# Altium project CW330_NewKintexFPGA.PrjPcb (part 4 of 5)

## Sheet CW340_SPI_flashes.SchDoc: SPI Flash & Breakout
size Letter; Organization: NewAE Technology Inc.; Address1: 1083 Queen St., Suite 196; Address2: Halifax; Address3: NS; Address4: Canada B3H 0B2; DocumentNumber: .; Revision: .; SheetNumber: 24; SheetTotal: 31; SheetApproved: NO
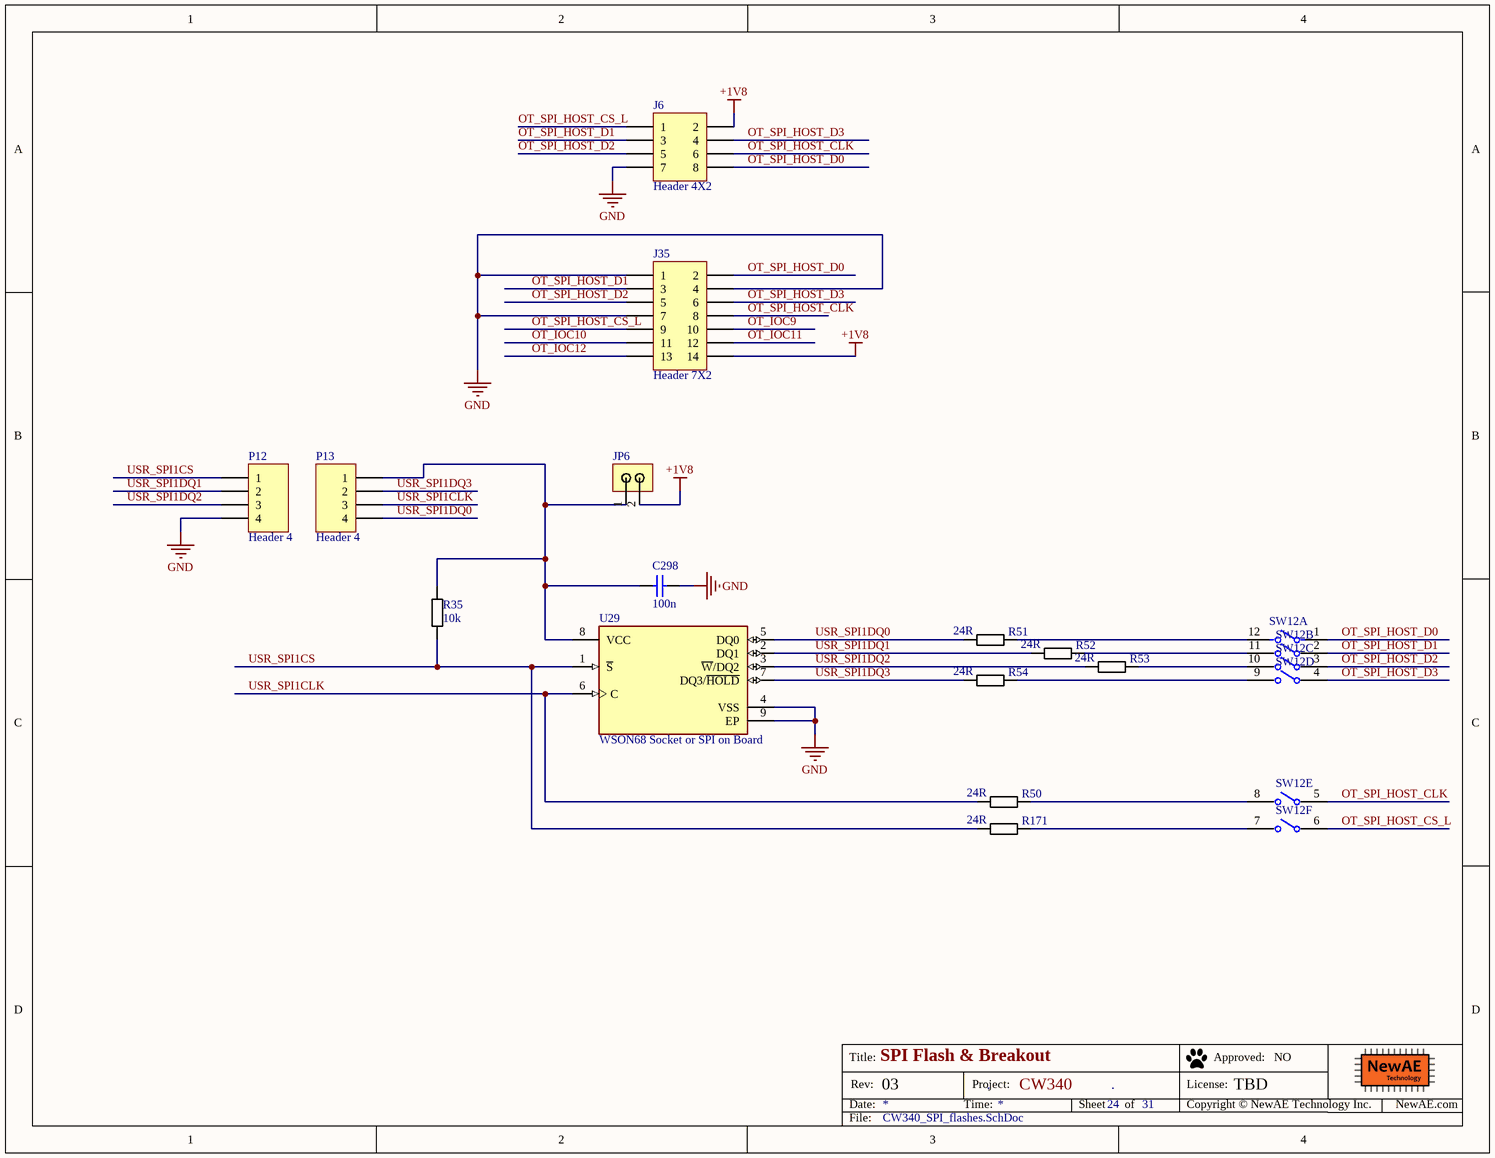
[diagram p21: CW340_SPI_flashes.SchDoc]

### Parts
C298  100n  [CAPC0402_M]
J6  Header 4X2  [HDR2X4]
J35  Header 7X2  [HDR2X7]
JP6  Jumper  [2x2.54mm_Header]  (value not drawn)
P12  Header 4  [HDR1X4]
P13  Header 4  [HDR1X4]
R35  10k  [RESC1005X40N]
R50  24R  [RESC1005X40N]
R51  24R  [RESC1005X40N]
R52  24R  [RESC1005X40N]
R53  24R  [RESC1005X40N]
R54  24R  [RESC1005X40N]
R171  24R  [RESC1005X40N]
SW12  A6H-6101-PM  [FP-A6H-6101-PM-MFG]  (value not drawn)  (parts A,B,C,D,E,F of 6)
U29  WSON68 Socket or SPI on Board  [SOK-SPI-WSON68_ORCHIP]

### Nets
+1V8: J6.2 J35.14 JP6.2
GND: C298.2 J6.7 J35.1 J35.4 J35.7 P12.4 U29.4(VSS) U29.9(EP)
OT_IOC9: J35.10
OT_IOC10: J35.11
OT_IOC11: J35.12
OT_IOC12: J35.13
OT_SPI_HOST_CLK: J6.6 J35.8 SW12.5
OT_SPI_HOST_CS_L: J6.1 J35.9 SW12.6
OT_SPI_HOST_D0: J6.8 J35.2 SW12.1
OT_SPI_HOST_D1: J6.3 J35.3 SW12.2
OT_SPI_HOST_D2: J6.5 J35.5 SW12.3
OT_SPI_HOST_D3: J6.4 J35.6 SW12.4
USR_SPI1CLK: P13.3 R50.1 U29.6(C)
USR_SPI1CS: P12.1 R35.2 R171.1 U29.1(~{S})
USR_SPI1DQ0: P13.4 R51.1 U29.5(DQ0)
USR_SPI1DQ1: P12.2 R52.1 U29.2(DQ1)
USR_SPI1DQ2: P12.3 R53.1 U29.3(~{W}/DQ2)
USR_SPI1DQ3: P13.2 R54.1 U29.7(DQ3/~{HOLD})
NetC298_1: C298.1 JP6.1 P13.1 R35.1 U29.8(VCC)
NetR50_2: R50.2 SW12.8
NetR51_2: R51.2 SW12.12
NetR52_2: R52.2 SW12.11
NetR53_2: R53.2 SW12.10
NetR54_2: R54.2 SW12.9
NetR171_2: R171.2 SW12.7

### Notes on the sheet
- Title:
- Date:
- Rev:
- Time:
- Project:
- Sheet
- of
- License:
- Copyright © NewAE Technology Inc.
- Approved:
- NewAE.com
- File:

### Library data of the parts
C298 = CCHIP-100n-0402: as C33 on sheet CW340_SAM3X_PWR; Part Number: CCHIP-100n-0402; Footprint: 0402; Pin Count: 2; Value: 100n; Mounting Technology: SMT; Component Kind: Standard; Component Type: Standard; Supplier 1: Digi-Key; Supplier Part Number 1: 445-6901-1-ND
J6 = Header 4X2: Header, 4-Pin, Dual row; LatestRevisionDate: 17-Jul-2002; LatestRevisionNote: Re-released for DXP Platform.; Publisher: Altium Limited
J35 = Header 7X2: Header, 7-Pin, Dual row; LatestRevisionDate: 17-Jul-2002; LatestRevisionNote: Re-released for DXP Platform.; Publisher: Altium Limited
JP6 = 2_PIN_JUMPER: 1x2 2.54mm header, male pins; Manufacture 1: Harwin; Manufacture Part Number 1: M20-9990246; Component Group: PCB Feature; PP Material Stack: 0; Part Number: 2_PIN_JUMPER; Pin Count: 2; Supplier 1: Digi-Key; Supplier Part Number 1: 952-2262-ND; Mounting Technology: Through-hole; RoHS: Yes; Component Kind: Standard; Component Type: Standard; PP Rotation: 0
P12 P13 = Header 4: Header, 4-Pin; LatestRevisionDate: 17-Jul-2002; LatestRevisionNote: Re-released for DXP Platform.; Publisher: Altium Limited
R35 = RCHIP-10K-0402: as R213-R220 on sheet CW340_STATUS_LEDs; Part Number: RCHIP-10K-0402; Footprint: 0402; Pin Count: 2; Supplier 1: Digi-Key; Supplier Part Number 1: 311-10.0KLRCT-ND; Value: 10k; Tolerance: 1%; Mounting Technology: SMT; Temperature Range: -55C to 155C; Component Kind: Standard; Component Type: Standard
R50-R54 R171 = RCHIP-24R-0402: 24R res, 0402, 1%, 1/16W; Manufacture 1: Yageo; Manufacture Part Number 1: RC0402FR-0724RL; Component Group: Resistor; Case-EIA: 0402; Case-Metric: 1005; Rated Power: 0.063W; Rated Voltage: 75VDC; Part Number: RCHIP-24R-0402; Footprint: 0402; Pin Count: 2; Supplier 1: Digi-Key; Supplier Part Number 1: YAG3073CT-ND; Value: 24R; Tolerance: 1%; Mounting Technology: SMT; Temperature Range: -55C to 155C; Component Kind: Standard; Component Type: Standard
SW12 = A6H-6101-PM: 6 DIP switch SMD; Manufacture 1: Omron; PP Material Stack: 0; Part Number: A6H-6101-PM; Component Group: Switch; Footprint: SSOP-12; Manufacture Part Number 1: A6H-6101-PM; Pin Count: 12; Component Kind: Standard; Component Type: Standard; PP Rotation: 0; PP Rotation1: 0
U29 = SOK-SPI-WSON68_OR_QSPI: WSON-6x8 Socket OR WSON Flash; Manufacture 1: Dedi-Prog/Micron; Manufacture Part Number 1: SOK-SPI-WSON68 / MT25QL256ABA1EW9-0SIT; Component Group: Connector; PP Material Stack: 0; Part Number: SOK-SPI-WSON68_OR_QSPI; Footprint: WSON-8x6; Pin Count: 8; Supplier 1: Digi-Key; Mounting Technology: SMT; RoHS: Yes; Component Kind: Standard; Component Type: Standard; PP Rotation: 0; PP Rotation1: 0

## Sheet CW340_EdgeConnector.SchDoc: Edge Connector
size Letter; Organization: NewAE Technology Inc.; Address1: 1083 Queen St., Suite 196; Address2: Halifax; Address3: NS; Address4: Canada B3H 0B2; SheetApproved: NO
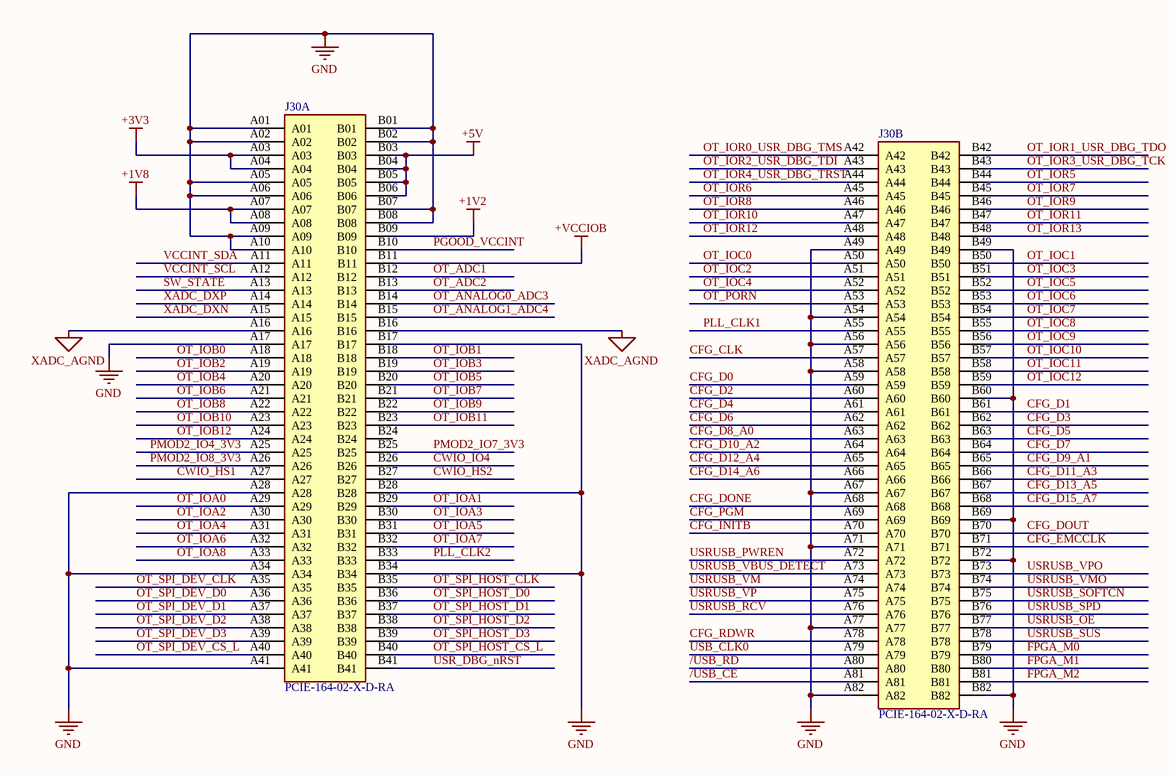
[diagram p22: CW340_EdgeConnector.SchDoc]

### Parts
J30  PCIE-164-02-X-D-RA  [SAMTEC_PCIE-164-02-X-D-RA]  (parts A,B of 2)

### Nets
+1V2: J30.B09
+1V8: J30.A07 J30.A08
+3V3: J30.A03 J30.A04
+5V: J30.B03 J30.B04 J30.B05 J30.B06
+VCCIOB: J30.B11
GND: J30.A01 J30.A02 J30.A05 J30.A06 J30.A09 J30.A10 J30.A17 J30.A28 J30.A34 J30.A41 J30.A49 J30.A54 J30.A56 J30.A58 J30.A67 J30.A71 J30.A77 J30.A82 J30.B01 J30.B02 J30.B07 J30.B08 J30.B17 J30.B28 J30.B34 J30.B49 J30.B60 J30.B69 J30.B72 J30.B82
XADC_AGND: J30.A16 J30.B16
/USB_CE: J30.A81
/USB_RD: J30.A80
CFG_CLK: J30.A57
CFG_D0: J30.A59
CFG_D1: J30.B61
CFG_D2: J30.A60
CFG_D3: J30.B62
CFG_D4: J30.A61
CFG_D5: J30.B63
CFG_D6: J30.A62
CFG_D7: J30.B64
CFG_D8_A0: J30.A63
CFG_D9_A1: J30.B65
CFG_D10_A2: J30.A64
CFG_D11_A3: J30.B66
CFG_D12_A4: J30.A65
CFG_D13_A5: J30.B67
CFG_D14_A6: J30.A66
CFG_D15_A7: J30.B68
CFG_DONE: J30.A68
CFG_DOUT: J30.B70
CFG_EMCCLK: J30.B71
CFG_INITB: J30.A70
CFG_PGM: J30.A69
CFG_RDWR: J30.A78
CWIO_HS1: J30.A27
CWIO_HS2: J30.B27
CWIO_IO4: J30.B26
FPGA_M0: J30.B79
FPGA_M1: J30.B80
FPGA_M2: J30.B81
OT_ADC1: J30.B12
OT_ADC2: J30.B13
OT_ANALOG0_ADC3: J30.B14
OT_ANALOG1_ADC4: J30.B15
OT_IOA0: J30.A29
OT_IOA1: J30.B29
OT_IOA2: J30.A30
OT_IOA3: J30.B30
OT_IOA4: J30.A31
OT_IOA5: J30.B31
OT_IOA6: J30.A32
OT_IOA7: J30.B32
OT_IOA8: J30.A33
OT_IOB0: J30.A18
OT_IOB1: J30.B18
OT_IOB2: J30.A19
OT_IOB3: J30.B19
OT_IOB4: J30.A20
OT_IOB5: J30.B20
OT_IOB6: J30.A21
OT_IOB7: J30.B21
OT_IOB8: J30.A22
OT_IOB9: J30.B22
OT_IOB10: J30.A23
OT_IOB11: J30.B23
OT_IOB12: J30.A24
OT_IOC0: J30.A50
OT_IOC1: J30.B50
OT_IOC2: J30.A51
OT_IOC3: J30.B51
OT_IOC4: J30.A52
OT_IOC5: J30.B52
OT_IOC6: J30.B53
OT_IOC7: J30.B54
OT_IOC8: J30.B55
OT_IOC9: J30.B56
OT_IOC10: J30.B57
OT_IOC11: J30.B58
OT_IOC12: J30.B59
OT_IOR0_USR_DBG_TMS: J30.A42
OT_IOR1_USR_DBG_TDO: J30.B42
OT_IOR2_USR_DBG_TDI: J30.A43
OT_IOR3_USR_DBG_TCK: J30.B43
OT_IOR4_USR_DBG_TRST: J30.A44
OT_IOR5: J30.B44
OT_IOR6: J30.A45
OT_IOR7: J30.B45
OT_IOR8: J30.A46
OT_IOR9: J30.B46
OT_IOR10: J30.A47
OT_IOR11: J30.B47
OT_IOR12: J30.A48
OT_IOR13: J30.B48
OT_PORN: J30.A53
OT_SPI_DEV_CLK: J30.A35
OT_SPI_DEV_CS_L: J30.A40
OT_SPI_DEV_D0: J30.A36
OT_SPI_DEV_D1: J30.A37
OT_SPI_DEV_D2: J30.A38
OT_SPI_DEV_D3: J30.A39
OT_SPI_HOST_CLK: J30.B35
OT_SPI_HOST_CS_L: J30.B40
OT_SPI_HOST_D0: J30.B36
OT_SPI_HOST_D1: J30.B37
OT_SPI_HOST_D2: J30.B38
OT_SPI_HOST_D3: J30.B39
PGOOD_VCCINT: J30.B10
PLL_CLK1: J30.A55
PLL_CLK2: J30.B33
PMOD2_IO4_3V3: J30.A25
PMOD2_IO7_3V3: J30.B25
PMOD2_IO8_3V3: J30.A26
SW_STATE: J30.A13
USB_CLK0: J30.A79
USR_DBG_nRST: J30.B41
USRUSB_OE: J30.B77
USRUSB_PWREN: J30.A72
USRUSB_RCV: J30.A76
USRUSB_SOFTCN: J30.B75
USRUSB_SPD: J30.B76
USRUSB_SUS: J30.B78
USRUSB_VBUS_DETECT: J30.A73
USRUSB_VM: J30.A74
USRUSB_VMO: J30.B74
USRUSB_VP: J30.A75
USRUSB_VPO: J30.B73
VCCINT_SCL: J30.A12  [project net PLL_SCL]
VCCINT_SDA: J30.A11  [project net PLL_SDA]
XADC_DXN: J30.A15
XADC_DXP: J30.A14

Not connected (* = marked no-connect by the designer): J30 B24

### Notes on the sheet
- Title:
- Date:
- Rev:
- Time:
- Project:
- Sheet
- of
- License:
- Copyright © NewAE Technology Inc.
- Approved:
- NewAE.com
- File:

### Library data of the parts
J30 = PCIE-164-02-X-D-RA: 1.00 mm PCI ExpressÂ® Edge Card Connector; MF: Samtec; Value: *; Price: None; Availability: Unavailable; Package: None; MP: PCIE-164-02-X-D-RA

## Sheet CW340_HyperDebug.SchDoc: <Enter Sheet Title>
size Letter; Organization: NewAE Technology Inc.; Address1: 1083 Queen St., Suite 196; Address2: Halifax; Address3: NS; Address4: Canada B3H 0B2; SheetApproved: NO
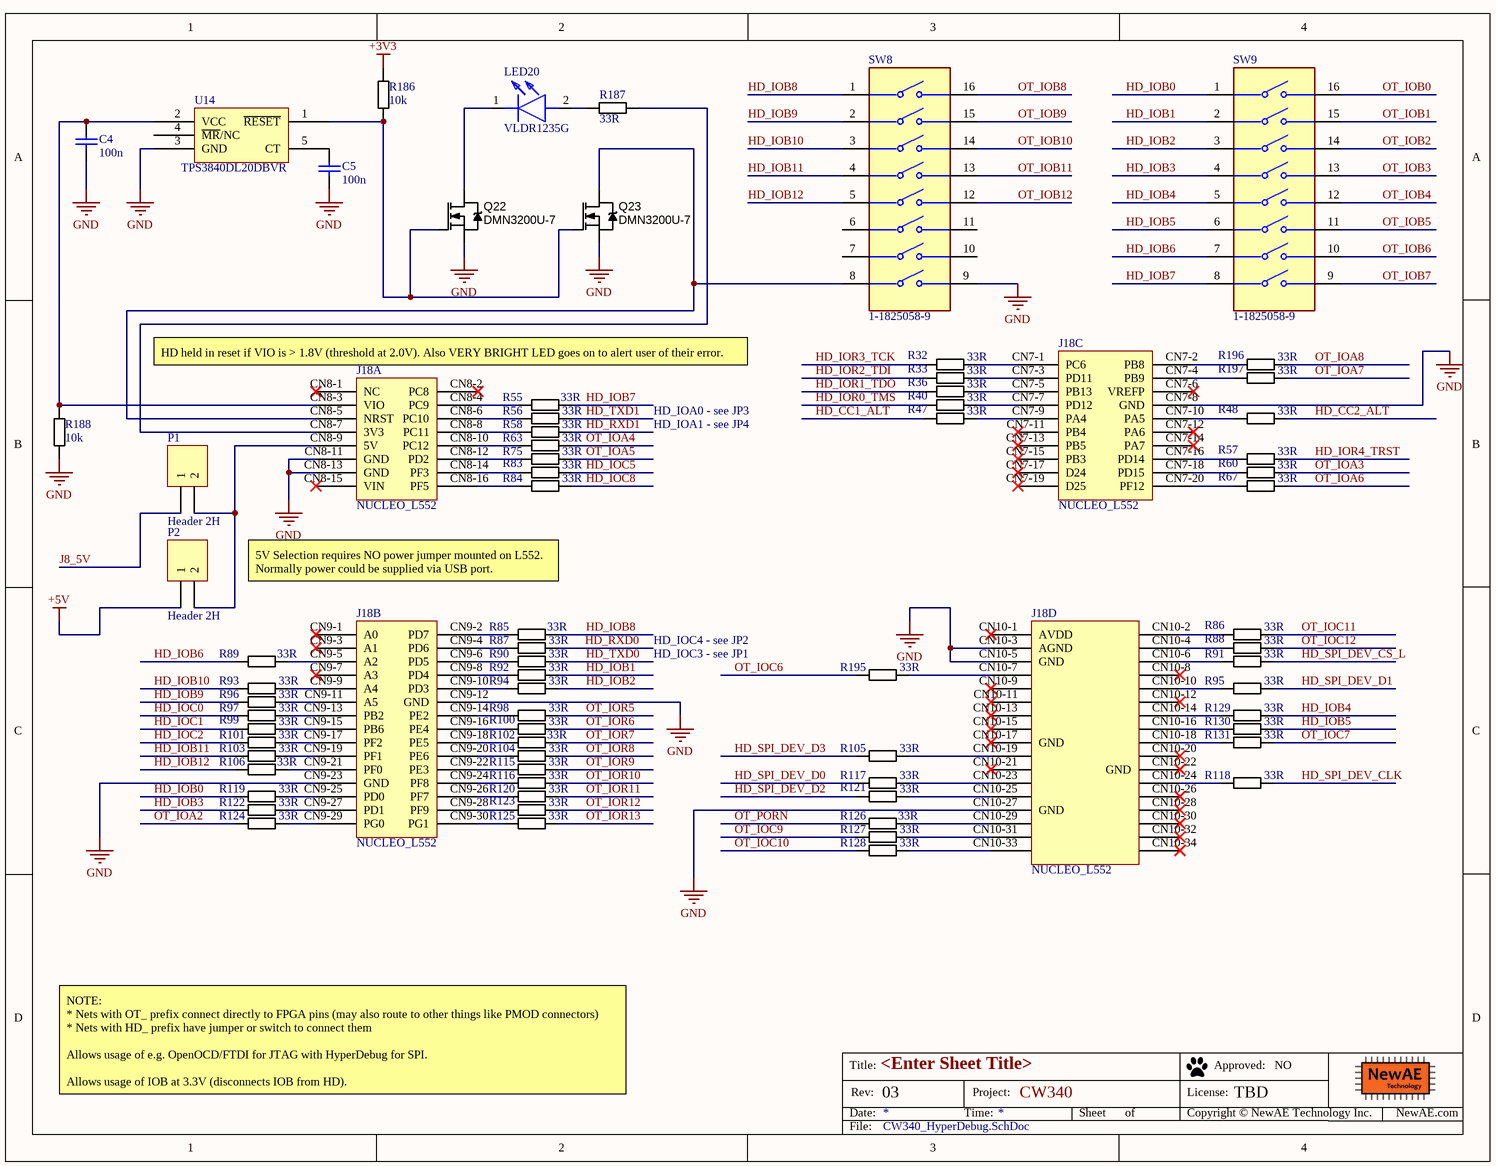
[diagram p23: CW340_HyperDebug.SchDoc]

### Parts
C4  100n  [CAPC0402_M]
C5  100n  [CAPC0402_M]
J18  NUCLEO_L552  [NUCLEO-L552ZE]  (parts A,B,C,D of 4)
LED20  VLDR1235G  [VLDR1235G]
P1  Header 2H  [HDR1X2H]
P2  Header 2H  [HDR1X2H]
Q22  DMN3200U-7  [SOT95P245X110-3M]
Q23  DMN3200U-7  [SOT95P245X110-3M]
R32  33R  [RESC1608X55N]
R33  33R  [RESC1608X55N]
R36  33R  [RESC1608X55N]
R40  33R  [RESC1608X55N]
R47  33R  [RESC1608X55N]
R48  33R  [RESC1608X55N]
R55  33R  [RESC1608X55N]
R56  33R  [RESC1608X55N]
R57  33R  [RESC1608X55N]
R58  33R  [RESC1608X55N]
R60  33R  [RESC1608X55N]
R63  33R  [RESC1608X55N]
R67  33R  [RESC1608X55N]
R75  33R  [RESC1608X55N]
R83  33R  [RESC1608X55N]
R84  33R  [RESC1608X55N]
R85  33R  [RESC1608X55N]
R86  33R  [RESC1608X55N]
R87  33R  [RESC1608X55N]
R88  33R  [RESC1608X55N]
R89  33R  [RESC1608X55N]
R90  33R  [RESC1608X55N]
R91  33R  [RESC1608X55N]
R92  33R  [RESC1608X55N]
R93  33R  [RESC1608X55N]
R94  33R  [RESC1608X55N]
R95  33R  [RESC1608X55N]
R96  33R  [RESC1608X55N]
R97  33R  [RESC1608X55N]
R98  33R  [RESC1608X55N]
R99  33R  [RESC1608X55N]
R100  33R  [RESC1608X55N]
R101  33R  [RESC1608X55N]
R102  33R  [RESC1608X55N]
R103  33R  [RESC1608X55N]
R104  33R  [RESC1608X55N]
R105  33R  [RESC1608X55N]
R106  33R  [RESC1608X55N]
R115  33R  [RESC1608X55N]
R116  33R  [RESC1608X55N]
R117  33R  [RESC1608X55N]
R118  33R  [RESC1608X55N]
R119  33R  [RESC1608X55N]
R120  33R  [RESC1608X55N]
R121  33R  [RESC1608X55N]
R122  33R  [RESC1608X55N]
R123  33R  [RESC1608X55N]
R124  33R  [RESC1608X55N]
R125  33R  [RESC1608X55N]
R126  33R  [RESC1608X55N]
R127  33R  [RESC1608X55N]
R128  33R  [RESC1608X55N]
R129  33R  [RESC1608X55N]
R130  33R  [RESC1608X55N]
R131  33R  [RESC1608X55N]
R186  10k  [RESC1005X40N]
R187  33R  [RESC1608X55N]
R188  10k  [RESC1005X40N]
R195  33R  [RESC1608X55N]
R196  33R  [RESC1608X55N]
R197  33R  [RESC1608X55N]
SW8  1-1825058-9  [FP-1-1825058-9-MFG]
SW9  1-1825058-9  [FP-1-1825058-9-MFG]
U14  TPS3840DL20DBVR  [SOT23-5P95_285X145L45X40]

### Nets
+3V3: R186.1
+5V: P2.1
GND: C4.2 C5.2 J18.CN7-8(GND) J18.CN8-11(GND) J18.CN8-13(GND) J18.CN9-12(GND) J18.CN9-23(GND) J18.CN10-3(AGND) J18.CN10-5(GND) J18.CN10-27(GND) Q22.2(S) Q23.2(S) R188.2 SW8.9 U14.3(GND)
HD_CC1_ALT: R47.1
HD_CC2_ALT: R48.2
HD_IOB0: R119.1 SW9.1
HD_IOB1: R92.2 SW9.2
HD_IOB2: R94.2 SW9.3
HD_IOB3: R122.1 SW9.4
HD_IOB4: R129.2 SW9.5
HD_IOB5: R130.2 SW9.6
HD_IOB6: R89.1 SW9.7
HD_IOB7: R55.2 SW9.8
HD_IOB8: R85.2 SW8.1
HD_IOB9: R96.1 SW8.2
HD_IOB10: R93.1 SW8.3
HD_IOB11: R103.1 SW8.4
HD_IOB12: R106.1 SW8.5
HD_IOC0: R97.1
HD_IOC1: R99.1
HD_IOC2: R101.1
HD_IOC5: R83.2
HD_IOC8: R84.2
HD_IOR0_TMS: R40.1
HD_IOR1_TDO: R36.1
HD_IOR2_TDI: R33.1
HD_IOR3_TCK: R32.1
HD_IOR4_TRST: R57.2
HD_RXD0: R87.2
HD_RXD1: R58.2
HD_SPI_DEV_CLK: R118.2
HD_SPI_DEV_CS_L: R91.2
HD_SPI_DEV_D0: R117.1
HD_SPI_DEV_D1: R95.2
HD_SPI_DEV_D2: R121.1
HD_SPI_DEV_D3: R105.1
HD_TXD0: R90.2
HD_TXD1: R56.2
J8_5V: P1.1
OT_IOA2: R124.1
OT_IOA3: R60.2
OT_IOA4: R63.2
OT_IOA5: R75.2
OT_IOA6: R67.2
OT_IOA7: R197.2
OT_IOA8: R196.2
OT_IOB0: SW9.16
OT_IOB1: SW9.15
OT_IOB2: SW9.14
OT_IOB3: SW9.13
OT_IOB4: SW9.12
OT_IOB5: SW9.11
OT_IOB6: SW9.10
OT_IOB7: SW9.9
OT_IOB8: SW8.16
OT_IOB9: SW8.15
OT_IOB10: SW8.14
OT_IOB11: SW8.13
OT_IOB12: SW8.12
OT_IOC6: R195.1
OT_IOC7: R131.2
OT_IOC9: R127.1
OT_IOC10: R128.1
OT_IOC11: R86.2
OT_IOC12: R88.2
OT_IOR5: R98.2
OT_IOR6: R100.2
OT_IOR7: R102.2
OT_IOR8: R104.2
OT_IOR9: R115.2
OT_IOR10: R116.2
OT_IOR11: R120.2
OT_IOR12: R123.2
OT_IOR13: R125.2
OT_PORN: R126.1
NetC4_1: C4.1 J18.CN8-3(VIO) R188.1 U14.2(VCC)
NetC5_1: C5.1 U14.5(CT)
NetJ18_CN7-1: J18.CN7-1(PC6) R32.2
NetJ18_CN7-2: J18.CN7-2(PB8) R196.1
NetJ18_CN7-3: J18.CN7-3(PD11) R33.2
NetJ18_CN7-4: J18.CN7-4(PB9) R197.1
NetJ18_CN7-5: J18.CN7-5(PB13) R36.2
NetJ18_CN7-7: J18.CN7-7(PD12) R40.2
NetJ18_CN7-9: J18.CN7-9(PA4) R47.2
NetJ18_CN7-10: J18.CN7-10(PA5) R48.1
NetJ18_CN7-16: J18.CN7-16(PD14) R57.1
NetJ18_CN7-18: J18.CN7-18(PD15) R60.1
NetJ18_CN7-20: J18.CN7-20(PF12) R67.1
NetJ18_CN8-4: J18.CN8-4(PC9) R55.1
NetJ18_CN8-5: J18.CN8-5(NRST) Q23.3(D) SW8.8
NetJ18_CN8-6: J18.CN8-6(PC10) R56.1
NetJ18_CN8-7: J18.CN8-7(3V3) R187.2
NetJ18_CN8-8: J18.CN8-8(PC11) R58.1
NetJ18_CN8-9: J18.CN8-9(5V) P1.2 P2.2
NetJ18_CN8-10: J18.CN8-10(PC12) R63.1
NetJ18_CN8-12: J18.CN8-12(PD2) R75.1
NetJ18_CN8-14: J18.CN8-14(PF3) R83.1
NetJ18_CN8-16: J18.CN8-16(PF5) R84.1
NetJ18_CN9-2: J18.CN9-2(PD7) R85.1
NetJ18_CN9-4: J18.CN9-4(PD6) R87.1
NetJ18_CN9-5: J18.CN9-5(A2) R89.2
NetJ18_CN9-6: J18.CN9-6(PD5) R90.1
NetJ18_CN9-8: J18.CN9-8(PD4) R92.1
NetJ18_CN9-9: J18.CN9-9(A4) R93.2
NetJ18_CN9-10: J18.CN9-10(PD3) R94.1
NetJ18_CN9-11: J18.CN9-11(A5) R96.2
NetJ18_CN9-13: J18.CN9-13(PB2) R97.2
NetJ18_CN9-14: J18.CN9-14(PE2) R98.1
NetJ18_CN9-15: J18.CN9-15(PB6) R99.2
NetJ18_CN9-16: J18.CN9-16(PE4) R100.1
NetJ18_CN9-17: J18.CN9-17(PF2) R101.2
NetJ18_CN9-18: J18.CN9-18(PE5) R102.1
NetJ18_CN9-19: J18.CN9-19(PF1) R103.2
NetJ18_CN9-20: J18.CN9-20(PE6) R104.1
NetJ18_CN9-21: J18.CN9-21(PF0) R106.2
NetJ18_CN9-22: J18.CN9-22(PE3) R115.1
NetJ18_CN9-24: J18.CN9-24(PF8) R116.1
NetJ18_CN9-25: J18.CN9-25(PD0) R119.2
NetJ18_CN9-26: J18.CN9-26(PF7) R120.1
NetJ18_CN9-27: J18.CN9-27(PD1) R122.2
NetJ18_CN9-28: J18.CN9-28(PF9) R123.1
NetJ18_CN9-29: J18.CN9-29(PG0) R124.2
NetJ18_CN9-30: J18.CN9-30(PG1) R125.1
NetJ18_CN10-2: J18.CN10-2 R86.1
NetJ18_CN10-4: J18.CN10-4 R88.1
NetJ18_CN10-6: J18.CN10-6 R91.1
NetJ18_CN10-7: J18.CN10-7 R195.2
NetJ18_CN10-10: J18.CN10-10 R95.1
NetJ18_CN10-14: J18.CN10-14 R129.1
NetJ18_CN10-16: J18.CN10-16 R130.1
NetJ18_CN10-18: J18.CN10-18 R131.1
NetJ18_CN10-19: J18.CN10-19 R105.2
NetJ18_CN10-23: J18.CN10-23 R117.2
NetJ18_CN10-24: J18.CN10-24 R118.1
NetJ18_CN10-25: J18.CN10-25 R121.2
NetJ18_CN10-29: J18.CN10-29 R126.2
NetJ18_CN10-31: J18.CN10-31 R127.2
NetJ18_CN10-33: J18.CN10-33 R128.2
NetLED20_1: LED20.1(K) Q22.3(D)
NetLED20_2: LED20.2(A) R187.1
NetQ22_1: Q22.1(G) Q23.1(G) R186.2 U14.1(~{RESET})

Not connected (* = marked no-connect by the designer): J18 CN7-6(VREFP)* CN7-11(PB4)* CN7-12(PA6)* CN7-13(PB5)* CN7-14(PA7)* CN7-15(PB3)* CN7-17(D24)* CN7-19(D25)* CN8-1(NC)* CN8-2(PC8)* CN8-15(VIN)* CN9-1(A0)* CN9-3(A1)* CN9-7(A3)* CN10-1(AVDD)* CN10-8* CN10-9* CN10-11* CN10-12* CN10-13* CN10-15* CN10-17(GND)* CN10-20* CN10-21* CN10-22(GND)* CN10-26* CN10-28* CN10-30* CN10-32* CN10-34*; SW8 6 7 10 11; U14 4(~{MR}/NC)

### Notes on the sheet
- HD held in reset if VIO is > 1.8V (threshold at 2.0V). Also VERY BRIGHT LED goes on to alert user of their error.
- HD_IOA0 - see JP3
- HD_IOA1 - see JP4
- 5V Selection requires NO power jumper mounted on L552. Normally power could be supplied via USB port.
- HD_IOC4 - see JP2
- HD_IOC3 - see JP1
- NOTE:
  * Nets with OT_ prefix connect directly to FPGA pins (may also route to other things like PMOD connectors)
  * Nets with HD_ prefix have jumper or switch to connect them
  Allows usage of e.g. OpenOCD/FTDI for JTAG with HyperDebug for SPI.
  Allows usage of IOB at 3.3V (disconnects IOB from HD).
- Title:
- Date:
- Rev:
- Time:
- Project:
- Sheet
- of
- License:
- Copyright © NewAE Technology Inc.
- Approved:
- NewAE.com
- File:

### Library data of the parts
C4 C5 = CCHIP-100n-0402: as C33 on sheet CW340_SAM3X_PWR; Part Number: CCHIP-100n-0402; Footprint: 0402; Pin Count: 2; Supplier 1: Digi-Key; Supplier Part Number 1: 445-6901-1-ND; Value: 100n; Mounting Technology: SMT; Component Kind: Standard; Component Type: Standard
J18 = NUCLEO_L552: PP Material Stack: 0; Part Number: NUCLEO_L552; Footprint: NUCLEO_L552; Component Kind: Standard; Component Type: Standard; PP Rotation: 0; PP Rotation1: 0
LED20 = VLDR1235G: LED; Manufacturer_Name: Vishay; Datasheet Link: https://componentsearchengine.com/Datasheets/2/VLDR1235G.pdf; Height: 3.02mm; Manufacturer_Part_Number: VLDR1235G; Mouser Part Number: 78-VLDR1235G; Mouser Price/Stock: https://www.mouser.co.uk/ProductDetail/Vishay-Semiconductors/VLDR1235G?qs=8%2FCviTG%2FVKTO7E0D0YN3Xw%3D%3D; Arrow Part Number: VLDR1235G; Arrow Price/Stock: https://www.arrow.com/en/products/vldr1235g/vishay?region=nac
P1 P2 = Header 2H: Header, 2-Pin, Right Angle; LatestRevisionDate: 17-Jul-2002; LatestRevisionNote: Re-released for DXP Platform.; Publisher: Altium Limited
Q22 Q23 = DMN3200U-7: MOSFET N-CH 30V 2.2A SOT23-3; Manufacture 1: Diodes Inc.; Rated Power: 3A; PP Material Stack: 0; Part Number: DMN3200U-7; Component Group: MOSFET; Footprint: SOT23; Manufacture Part Number 1: DMN3200U-7; Pin Count: 3; Supplier 1: Digi-Key; Supplier Part Number 1: DMN3200U-7DICT-ND; Rated Voltage: 30V; Mounting Technology: SMT; RoHS: Yes; Component Kind: Standard; Component Type: Standard; PP Rotation: 0
R32 R33 R36 R40 R47 R48 R55-R58 R60 R63 R67 R75 R83-R106 R115-R131 R187 R195-R197 = RCHIP-33R-0603: 33R res, 0603, 1%, 1/10W; Manufacture 1: Yageo; Manufacture Part Number 1: RC0603FR-0733RL; Component Group: Resistor; Case-EIA: 0603; Case-Metric: 1608; Rated Power: 0.1W; Rated Voltage: 75VDC; Part Number: RCHIP-33R-0603; Footprint: 0603; Pin Count: 2; Supplier 1: Digi-Key; Supplier Part Number 1: 311-33.0HRCT-ND; Value: 33R; Tolerance: 1%; Mounting Technology: SMT; Temperature Range: -55C to 155C; Component Kind: Standard; Component Type: Standard
R186 R188 = RCHIP-10K-0402: as R213-R220 on sheet CW340_STATUS_LEDs; Part Number: RCHIP-10K-0402; Footprint: 0402; Pin Count: 2; Supplier 1: Digi-Key; Supplier Part Number 1: 311-10.0KLRCT-ND; Value: 10k; Tolerance: 1%; Mounting Technology: SMT; Temperature Range: -55C to 155C; Component Kind: Standard; Component Type: Standard
SW8 SW9 = CMP-03400-000015-1: SWITCH SLIDE DIP SPST 100MA 24V; Manufacturer: TE Connectivity; Current Rating: 1A; Electromechanical Life: 1000Cycles; Contact Resistance: 50mΩ; Number Of Circuits: 8; Device Class L1: Electromechanical; Manufacturer Part Number: 1-1825058-9; Height: 5.1mm; ComponentLink2Description: Datasheet; Temperature Range High: +85°C; Digikey Description: SWITCH SLIDE DIP SPST 100MA 24V; Voltage Rating Dc: 24V; Package: 0; Automotive: No; ComponentLink2URL: https://www.te.com/commerce/DocumentDelivery/DDEController?Action=showdoc&DocId=Customer+Drawing%7F1825058%7FS5%7Fpdf%7FEnglish%7FENG_CD_1825058_S5.pdf%7F1-1825058-9; Octopart: https://octopart.com/1-1825058-9-te+connectivity-46507285; Temperature Range Low: -30°C; Device Class L2: Switches; Contact Current Rating: 100mA; Mount: Surface Mount; Temperature: -30°C to +85°C; Category: Switch; Device Class L3: DIP Switches; Lead Free: Yes; Throw Configuration: SPST; RoHS: TRUE
U14 = TPS3840DL20DBVR: Reset Supervisor; Manufacture 1: Texas Instruments; Component Group: Analog IC; PP Material Stack: 0; Part Number: TPS3840DL20DBVR; Footprint: SOT25; Manufacture Part Number 1: TPS3840DL20DBVR; Pin Count: 5; Supplier 1: Digi-Key; Supplier Part Number 1: TPS3840DL20DBVRCT-ND; Mounting Technology: SMT; RoHS: Yes; Component Kind: Standard; Component Type: Standard; PP Rotation: 0

## Sheet CW340_FTDI.SchDoc: FTDI Controller
size Letter; Organization: NewAE Technology Inc.; Address1: 1083 Queen St., Suite 196; Address2: Halifax; Address3: NS; Address4: Canada B3H 0B2; DocumentNumber: .; Revision: .; SheetApproved: NO
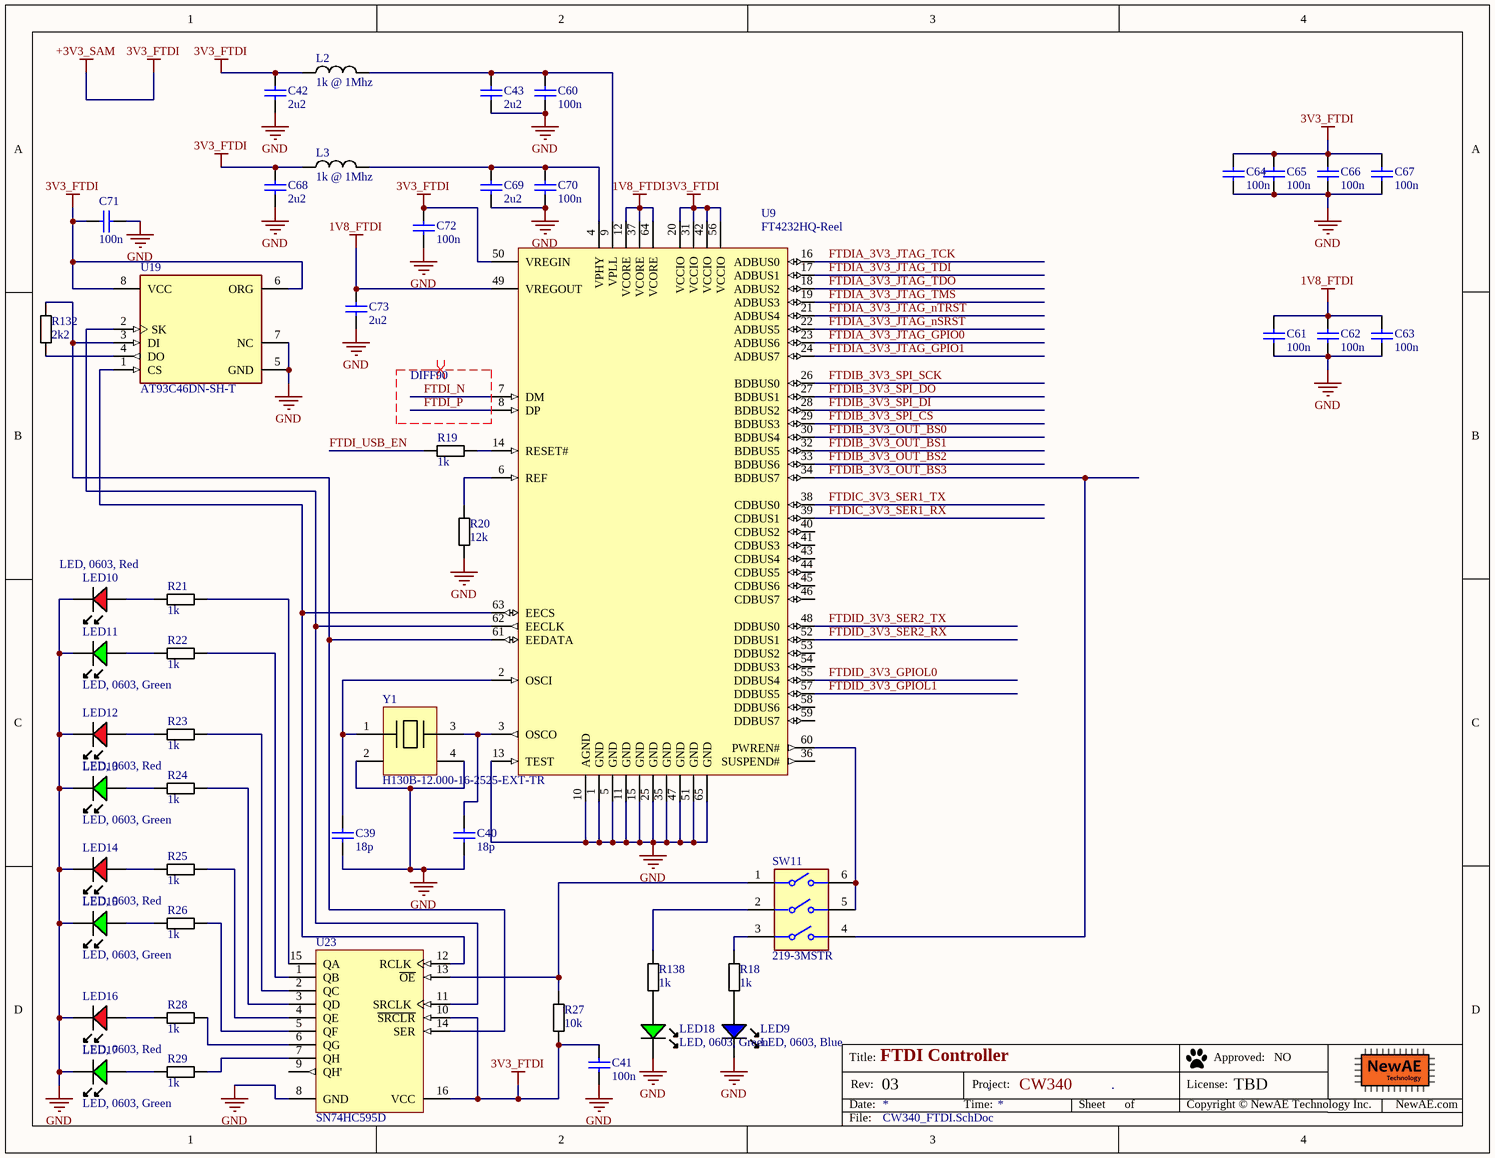
[diagram p24: CW340_FTDI.SchDoc]

### Parts
C39  18p  [CAPC0402_M]
C40  18p  [CAPC0402_M]
C41  100n  [CAPC0402_M]
C42  2u2  [CAPC0603_M]
C43  2u2  [CAPC0603_M]
C60  100n  [CAPC0402_M]
C61  100n  [CAPC0402_M]
C62  100n  [CAPC0402_M]
C63  100n  [CAPC0402_M]
C64  100n  [CAPC0402_M]
C65  100n  [CAPC0402_M]
C66  100n  [CAPC0402_M]
C67  100n  [CAPC0402_M]
C68  2u2  [CAPC0603_M]
C69  2u2  [CAPC0603_M]
C70  100n  [CAPC0402_M]
C71  100n  [CAPC0402_M]
C72  100n  [CAPC0402_M]
C73  2u2  [CAPC0603_M]
L2  1k @ 1Mhz  [IND_0603]
L3  1k @ 1Mhz  [IND_0603]
LED9  LED, 0603, Blue  [LED-0603-BLUE]
LED10  LED, 0603, Red  [LED-0603-RED]
LED11  LED, 0603, Green  [LED-0603-GREEN]
LED12  LED, 0603, Red  [LED-0603-RED]
LED13  LED, 0603, Green  [LED-0603-GREEN]
LED14  LED, 0603, Red  [LED-0603-RED]
LED15  LED, 0603, Green  [LED-0603-GREEN]
LED16  LED, 0603, Red  [LED-0603-RED]
LED17  LED, 0603, Green  [LED-0603-GREEN]
LED18  LED, 0603, Green  [LED-0603-GREEN]
R18  1k  [RESC1005X40N]
R19  1k  [RESC1005X40N]
R20  12k  [RESC1608X55N]
R21  1k  [RESC1005X40N]
R22  1k  [RESC1005X40N]
R23  1k  [RESC1005X40N]
R24  1k  [RESC1005X40N]
R25  1k  [RESC1005X40N]
R26  1k  [RESC1005X40N]
R27  10k  [RESC1005X40N]
R28  1k  [RESC1005X40N]
R29  1k  [RESC1005X40N]
R132  2k2  [RESC1005X40N]
R138  1k  [RESC1005X40N]
SW11  219-3MSTR  [FP-219-3MSTR-MFG]
U9  FT4232HQ-Reel  [QFN64_2_L]
U19  AT93C46DN-SH-T  [FP-C04-057-SN-MFG]
U23  SN74HC595D  [D0016A_L]
Y1  H130B-12.000-16-2525-EXT-TR  [5x3.2MM XTAL]

### Nets
1V8_FTDI: C61.1 C62.1 C63.1 C73.1 U9.12(VCORE) U9.37(VCORE) U9.49(VREGOUT) U9.64(VCORE)
+3V3_SAM: C41.1 C42.1 C64.1 C65.1 C66.1 C67.1 C68.1 C71.1 C72.1 L2.1 L3.1 R27.2 U9.20(VCCIO) U9.31(VCCIO) U9.42(VCCIO) U9.50(VREGIN) U9.56(VCCIO) U19.6(ORG) U19.8(VCC) U23.10(~{SRCLR}) U23.16(VCC)  [also labelled 3V3_FTDI]  [project net +3V3_SAM_VDDANA]
GND: C39.2 C40.2 C41.2 C42.2 C43.2 C60.2 C61.2 C62.2 C63.2 C64.2 C65.2 C66.2 C67.2 C68.2 C69.2 C70.2 C71.2 C72.2 C73.2 LED9.K LED10.K LED11.K LED12.K LED13.K LED14.K LED15.K LED16.K LED17.K LED18.K R20.2 U9.1(GND) U9.5(GND) U9.10(AGND) U9.11(GND) U9.13(TEST) U9.15(GND) U9.25(GND) U9.35(GND) U9.47(GND) U9.51(GND) U9.65(GND) U19.5(GND) U19.7(NC) U23.8(GND) Y1.2 Y1.4
FTDI_N: U9.7(DM)
FTDI_P: U9.8(DP)
FTDI_USB_EN: R19.2
FTDIA_3V3_JTAG_GPIO0: U9.23(ADBUS6)
FTDIA_3V3_JTAG_GPIO1: U9.24(ADBUS7)
FTDIA_3V3_JTAG_nSRST: U9.22(ADBUS5)
FTDIA_3V3_JTAG_nTRST: U9.21(ADBUS4)
FTDIA_3V3_JTAG_TCK: U9.16(ADBUS0)
FTDIA_3V3_JTAG_TDI: U9.17(ADBUS1)
FTDIA_3V3_JTAG_TDO: U9.18(ADBUS2)
FTDIA_3V3_JTAG_TMS: U9.19(ADBUS3)
FTDIB_3V3_OUT_BS0: U9.30(BDBUS4)
FTDIB_3V3_OUT_BS1: U9.32(BDBUS5)
FTDIB_3V3_OUT_BS2: U9.33(BDBUS6)
FTDIB_3V3_OUT_BS3: SW11.4 U9.34(BDBUS7)
FTDIB_3V3_SPI_CS: U9.29(BDBUS3)
FTDIB_3V3_SPI_DI: U9.28(BDBUS2)
FTDIB_3V3_SPI_DO: U9.27(BDBUS1)
FTDIB_3V3_SPI_SCK: U9.26(BDBUS0)
FTDIC_3V3_SER1_RX: U9.39(CDBUS1)
FTDIC_3V3_SER1_TX: U9.38(CDBUS0)
FTDID_3V3_GPIOL0: U9.55(DDBUS4)
FTDID_3V3_GPIOL1: U9.57(DDBUS5)
FTDID_3V3_SER2_RX: U9.52(DDBUS1)
FTDID_3V3_SER2_TX: U9.48(DDBUS0)
NetC39_1: C39.1 U9.2(OSCI) Y1.1
NetC40_1: C40.1 U9.3(OSCO) Y1.3
NetC43_1: C43.1 C60.1 L2.2 U9.9(VPLL)
NetC69_1: C69.1 C70.1 L3.2 U9.4(VPHY)
NetLED9_A: LED9.A R18.2
NetLED10_A: LED10.A R21.2
NetLED11_A: LED11.A R22.2
NetLED12_A: LED12.A R23.2
NetLED13_A: LED13.A R24.2
NetLED14_A: LED14.A R25.2
NetLED15_A: LED15.A R26.2
NetLED16_A: LED16.A R28.2
NetLED17_A: LED17.A R29.2
NetLED18_A: LED18.A R138.2
NetR18_1: R18.1 SW11.3
NetR19_1: R19.1 U9.14(RESET#)
NetR20_1: R20.1 U9.6(REF)
NetR21_1: R21.1 U23.15(QA)
NetR22_1: R22.1 U23.1(QB)
NetR23_1: R23.1 U23.2(QC)
NetR24_1: R24.1 U23.3(QD)
NetR25_1: R25.1 U23.4(QE)
NetR26_1: R26.1 U23.5(QF)
NetR27_1: R27.1 SW11.1 U23.13(~{OE})
NetR28_1: R28.1 U23.6(QG)
NetR29_1: R29.1 U23.7(QH)
NetR132_1: R132.1 U9.61(EEDATA) U19.3(DI) U23.14(SER)
NetR132_2: R132.2 U19.4(DO)
NetR138_1: R138.1 SW11.2
NetSW11_5: SW11.5 SW11.6 U9.60(PWREN#)
NetU9_62: U9.62(EECLK) U19.2(SK) U23.11(SRCLK)
NetU9_63: U9.63(EECS) U19.1(CS) U23.12(RCLK)

Not connected (* = marked no-connect by the designer): U9 36(SUSPEND#) 40(CDBUS2) 41(CDBUS3) 43(CDBUS4) 44(CDBUS5) 45(CDBUS6) 46(CDBUS7) 53(DDBUS2) 54(DDBUS3) 58(DDBUS6) 59(DDBUS7); U23 9(QH')

### Layout directives
differential pair; differential pair class DIFF90: FTDI_N, FTDI_P

### Notes on the sheet
- Title:
- Date:
- Rev:
- Time:
- Project:
- Sheet
- of
- License:
- Copyright © NewAE Technology Inc.
- Approved:
- NewAE.com
- File:

### Library data of the parts
C39 C40 = CCHIP-18p-0402: 18p, 0402; Manufacture Part Number 1: GRM1555C1H180JA01D; Component Group: Capacitor; Case-EIA: 0402; Part Number: CCHIP-18p-0402; Footprint: 0402; Pin Count: 2; Supplier 1: Digi-Key; Supplier Part Number 1: 490-5858-1-ND; Value: 18p; Mounting Technology: SMT; Component Kind: Standard; Component Type: Standard
C41 C60-C67 C70-C72 = CCHIP-100n-0402: 100n, 0402; Manufacture Part Number 1: CGA2B3X7R1V104K050BB; Component Group: Capacitor; Case-EIA: 0402; Part Number: CCHIP-100n-0402; Footprint: 0402; Pin Count: 2; Supplier 1: Digi-Key; Supplier Part Number 1: 445-6901-1-ND; Value: 100n; Mounting Technology: SMT; Component Kind: Standard; Component Type: Standard
C42 C43 C68 C69 C73 = CCHIP-2u2-0603: 2u2, 0603; Manufacture 1: Samsung; Manufacture Part Number 1: CL10B225KP8NNNC; Component Group: Capacitor; Case-EIA: 0603; Case-Metric: 1608; Rated Voltage: 10VDC; Part Number: CCHIP-2u2-0603; Footprint: 0603; Pin Count: 2; Supplier 1: Digi-Key; Supplier Part Number 1: 1276-1134-1-ND; Value: 2u2; Mounting Technology: SMT; Component Kind: Standard; Component Type: Standard
L2 L3 = FBCHIP-1k-0603: Ferrite Beads HI CUR CHIP BD 0603 1000OHMS 25%; Manufacture 1: Taiyo Yuden; Manufacture Part Number 1: FBMH1608HM102-T / FBMH1608HM102-T / FBMH1608HM102-T / FBMH1608HM102-T; Component Group: Inductor; PP Material Stack: 0; Part Number: FBCHIP-1k-0603; Footprint: 0603; Pin Count: 2; Supplier 1: Mouser; Supplier Part Number 1: 963-FBMH1608HM102-T; Mounting Technology: SMT; RoHS: Yes; Component Kind: Standard; Component Type: Standard; PP Rotation: 0
LED9 = LEDCHIP_0603_BLUE: Chip LED, Blue; Manufacture 1: Kingbright; Manufacture Part Number 1: APT1608QBC/D; Component Group: Optical; Part Number: LEDCHIP_0603_BLUE; Pin Count: 2; Mounting Technology: SMT; Component Kind: Standard; Component Type: Standard
LED10 LED12 LED14 LED16 = LEDCHIP_0603_RED: Chip LED, Red; Manufacture 1: Kingbright; Manufacture Part Number 1: APT1608SRCPRV; Component Group: Optical; PP Material Stack: 15; PP Rotation: -90; Part Number: LEDCHIP_0603_RED; Pin Count: 2; Supplier 1: Digi-Key; Supplier Part Number 1: 754-1122-1-ND; Mounting Technology: SMT; Component Kind: Standard; Component Type: Standard
LED11 LED13 LED15 LED17 LED18 = LEDCHIP_0603_GREEN: Chip LED, Green; Manufacture 1: Kingbright; Manufacture Part Number 1: APT1608CGCK; Component Group: Optical; PP Material Stack: 16; PP Rotation: -90; Part Number: LEDCHIP_0603_GREEN; Pin Count: 2; Supplier 1: Digi-Key; Supplier Part Number 1: 754-1116-1-ND; Mounting Technology: SMT; Component Kind: Standard; Component Type: Standard
R18 R19 R21-R26 R28 R29 R138 = RCHIP-1K-0402: 1k res, 0402, 1%, 1/16W; Manufacture 1: Yageo; Manufacture Part Number 1: RC0402FR-071KL; Component Group: Resistor; Case-EIA: 0402; Case-Metric: 1005; Rated Power: 0.063W; Rated Voltage: 75VDC; Part Number: RCHIP-1K-0402; Footprint: 0402; Pin Count: 2; Supplier 1: Digi-Key; Supplier Part Number 1: 311-1.00KLRCT-ND; Value: 1k; Tolerance: 1%; Mounting Technology: SMT; Temperature Range: -55C to 155C; Component Kind: Standard; Component Type: Standard
R20 = RCHIP-12K-0603: 12k res, 0603, 1%, 1/10W; Manufacture 1: Yageo; Manufacture Part Number 1: RC0603FR-0712KL; Component Group: Resistor; Case-EIA: 0603; Case-Metric: 1608; Rated Power: 0.1W; Rated Voltage: 75VDC; Part Number: RCHIP-12K-0603; Footprint: 0603; Pin Count: 2; Supplier 1: Digi-Key; Supplier Part Number 1: 311-12.0KHRCT-ND; Value: 12k; Tolerance: 1%; Mounting Technology: SMT; Temperature Range: -55C to 155C; Component Kind: Standard; Component Type: Standard
R27 = RCHIP-10K-0402: 10k res, 0402, 1%, 1/16W; Manufacture 1: Yageo; Manufacture Part Number 1: RC0402FR-0710KL; Component Group: Resistor; Case-EIA: 0402; Case-Metric: 1005; Rated Power: 0.063W; Rated Voltage: 75VDC; Part Number: RCHIP-10K-0402; Footprint: 0402; Pin Count: 2; Supplier 1: Digi-Key; Supplier Part Number 1: 311-10.0KLRCT-ND; Value: 10k; Tolerance: 1%; Mounting Technology: SMT; Temperature Range: -55C to 155C; Component Kind: Standard; Component Type: Standard
R132 = RCHIP-2K2-0402: 2k2 res, 0402, 1%, 1/16W; Manufacture 1: Yageo; Manufacture Part Number 1: RC0402FR-072K2L; Component Group: Resistor; Case-EIA: 0402; Case-Metric: 1005; Rated Power: 0.063W; Rated Voltage: 75VDC; Part Number: RCHIP-2K2-0402; Footprint: 0402; Pin Count: 2; Supplier 1: Digi-Key; Supplier Part Number 1: 311-2.20KLRCT-ND; Value: 2k2; Tolerance: 1%; Mounting Technology: SMT; Temperature Range: -55C to 155C; Component Kind: Standard; Component Type: Standard
SW11 = CMP-07018-000004-1: SWITCH SLIDE DIP SPST 100MA 20V; Washable: Yes; Mechanical Life: 2000Cycles; Number of Positions: 3; Pitch: 0.1inch; Actuator Type: Slide (Standard); Max Operating Temperature: 85°C; Voltage Rating (DC): 20V; Termination: Gull Wing; Length: 0.358inch; Min Operating Temperature: -55°C; Orientation: Straight; Mount: Surface Mount; Package Quantity: 1000; Current Rating: 100mA; Electrical Life: 2000Cycles; Max Current Rating: 100mA; Throw Configuration: SPST; Contact Material: Copper; Packaging: Tape and Reel; Contact Plating: Gold; Lead Free: Lead Free; Max Voltage Rating (DC): 20V
U9 = CMP-0078-00005-3: Quad High Speed USB To Multipurpose UART/MPSSE IC, 64-pin QFN, Tape and Reel; Manufacturer: FTDI; ComponentLink1URL: http://www.ftdichip.com/; ComponentLink2Description: Datasheet; ComponentLink2URL: http://www.ftdichip.com/Support/Documents/DataSheets/ICs/DS_FT4232H.pdf; PackageReference: QFN64_2; DatasheetVersion: ver 2.2, Jan-2012; PackageDescription: 64-Pin Quad Flat No-Lead, 9 x 9 mm Body, 0.5 mm Pitch, 4.35 x 4.35 mm Exposed Pad; RevisionNote: DatasheetVersion updated to 2.2 Jan-2012; PartNumber: FT4232HQ-Reel; PackageVersion: Jan-12; ComponentLink1Description: Manufacturer URL
U19 = CMP-06313-000016-1: IC EEPROM 1K SPI 2MHZ 8SOIC; Manufacturer: Microchip; Nominal Supply Current: 0.5mA; Memory Size: 1Kbits; Access Time: 1000ns; Max Supply Voltage: 5.5V; Interface: Other; Standoff Height: 0.1mm; Min Supply Voltage: 1.8V; Category: IC; Temperature Range High: +85°C; Mouser Description: EEPROM Serial-3Wire 1K-Bit 128 x 8/64 x 16 2.5V/3.3V/5V 8-Pin SOIC T/R; Ipc Land Pattern Name: SOIC127P600X175-8; Temperature Range Low: -40°C; Temperature: -40°C to +85°C; Digikey Description: IC EEPROM 1K SPI 2MHZ 8SOIC; Lead Free: Yes; Device Class L2: Memory; ComponentLink2URL: http://ww1.microchip.com/downloads/en/DeviceDoc/20006224B.pdf; Automotive: No; Device Class L3: EEPROM; Package: C04-057-SN; Octopart: https://octopart.com/at93c46dn-sh-t-microchip-77759177; RoHS: TRUE; Memory Type: EEPROM; Height: 1.75mm; Manufacturer Part Number: AT93C46DN-SH-T; ComponentLink2Description: Datasheet; Frequency: 2MHz; Device Class L1: Integrated Circuits (ICs)
U23 = CMP-0780-00038-3: 8-Bit Shift Registers With 3-State Output Registers, D0016A, TUBE; Manufacturer: Texas Instruments; Bits: 8; F @ Nom Voltage(Max)(Mhz): 28; Voltage(Nom)(V): 6; ICC @ Nom Voltage(Max)(mA): 0.08; Output Drive (IOL/IOH)(Max)(mA): 7.8/-7.8; tpd @ Nom Voltage(Max)(ns): 34; 3-State Output: Yes; VCC(Min)(V): 2; Output Type: CMOS; Technology Family: HC; Rating: Military; Generic Part Number: SN74HC595; PackageReference: D0016A; Code_JEDEC: MS-012 variation AC; Operating Temperature Range(C): -40 to 85; VCC(Max)(V): 6; DatasheetVersion: SCLS041H; Input Type: CMOS; PackageVersion: http://www.ti.com/lit/ml/mpds178g/mpds178g.pdf
Y1 = H130B-12.000-16-2525-EXT-TR: 12MHz ±25ppm Crystal 16pF 35 Ohms 4-SMD, No Lead; Manufacture 1: Raltron Electronics; Value: 12.000MHz; PP Material Stack: 0; Supplier 1: Digi-Key; Stock 1: 4955; Pricing 1: 1=0.590000, 10=0.488000, 50=0.439400, 100=0.390600, 500=0.371100 (USD); Supplier Part Number 1: 2151-H130B-12.000-16-2525-EXT-TR-ND; .Checked SCH: *; .Checked PCB: *; Manufacturer Part Number: H130B-12.000-16-2525-EXT-TR; Part Number: H130B-12.000-16-2525-EXT-TR; Component Group: Crystal; Footprint: 5x3.2mm; Manufacture Part Number 1: H130B-12.000-16-2525-EXT-TR; Pin Count: 4; Mounting Technology: SMT; Component Kind: Standard; Component Type: Standard; PP Rotation: 0

## Sheet CW340_FTDI_LevelShifting.SchDoc: <Enter Sheet Title>
size Letter; Organization: NewAE Technology Inc.; Address1: 1083 Queen St., Suite 196; Address2: Halifax; Address3: NS; Address4: Canada B3H 0B2; SheetApproved: NO
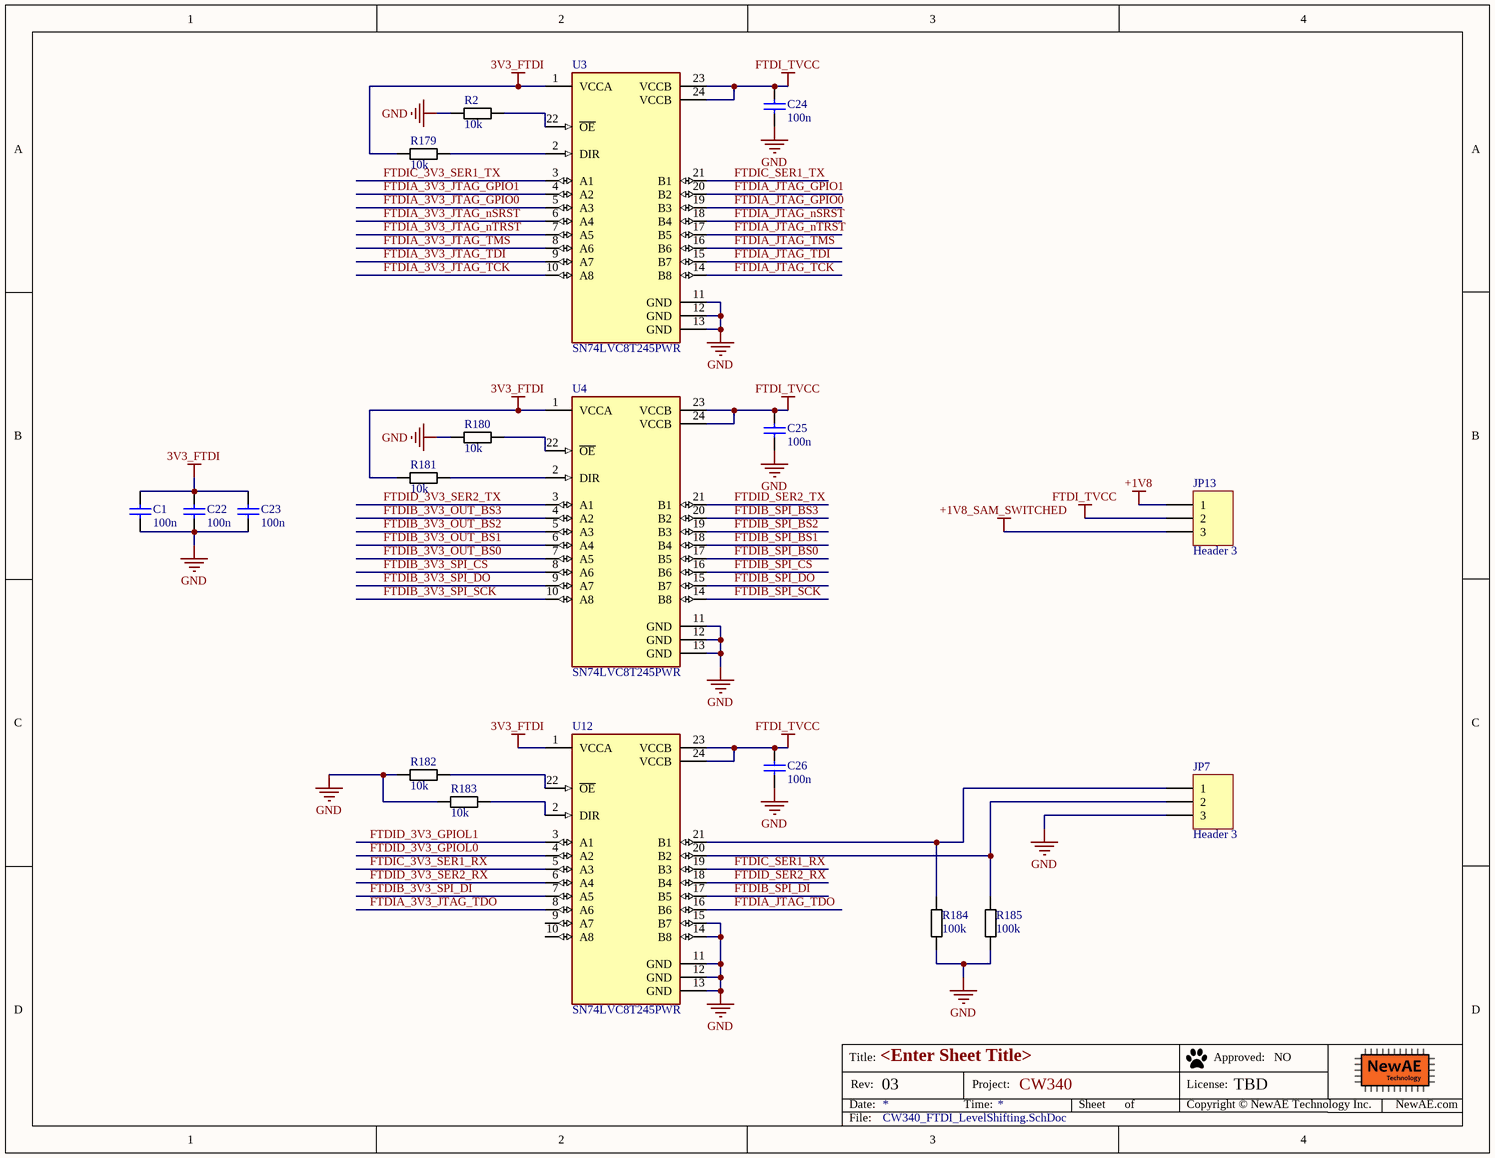
[diagram p25: CW340_FTDI_LevelShifting.SchDoc]

### Parts
C1  100n  [CAPC0402_M]
C22  100n  [CAPC0402_M]
C23  100n  [CAPC0402_M]
C24  100n  [CAPC0402_M]
C25  100n  [CAPC0402_M]
C26  100n  [CAPC0402_M]
JP7  Header 3  [HDR1X3]
JP13  Header 3  [HDR1X3]
R2  10k  [RESC1005X40N]
R179  10k  [RESC1005X40N]
R180  10k  [RESC1005X40N]
R181  10k  [RESC1005X40N]
R182  10k  [RESC1005X40N]
R183  10k  [RESC1005X40N]
R184  100k  [RESC1608X55N]
R185  100k  [RESC1608X55N]
U3  SN74LVC8T245PWR  [FP-PW0024A-MFG]
U4  SN74LVC8T245PWR  [FP-PW0024A-MFG]
U12  SN74LVC8T245PWR  [FP-PW0024A-MFG]

### Nets
3V3_FTDI: C1.1 C22.1 C23.1 R179.2 R181.2 U3.1(VCCA) U4.1(VCCA) U12.1(VCCA)  [project net +3V3_SAM_VDDANA]
+1V8: JP13.1
+1V8_SAM_SWITCHED: JP13.3
FTDI_TVCC: C24.1 C25.1 C26.1 JP13.2 U3.23(VCCB) U3.24(VCCB) U4.23(VCCB) U4.24(VCCB) U12.23(VCCB) U12.24(VCCB)
GND: C1.2 C22.2 C23.2 C24.2 C25.2 C26.2 JP7.3 R2.2 R180.2 R182.2 R183.2 R184.2 R185.2 U3.11(GND) U3.12(GND) U3.13(GND) U4.11(GND) U4.12(GND) U4.13(GND) U12.11(GND) U12.12(GND) U12.13(GND) U12.14(B8) U12.15(B7)
FTDIA_3V3_JTAG_GPIO0: U3.5(A3)
FTDIA_3V3_JTAG_GPIO1: U3.4(A2)
FTDIA_3V3_JTAG_nSRST: U3.6(A4)
FTDIA_3V3_JTAG_nTRST: U3.7(A5)
FTDIA_3V3_JTAG_TCK: U3.10(A8)
FTDIA_3V3_JTAG_TDI: U3.9(A7)
FTDIA_3V3_JTAG_TDO: U12.8(A6)
FTDIA_3V3_JTAG_TMS: U3.8(A6)
FTDIA_JTAG_GPIO0: U3.19(B3)
FTDIA_JTAG_GPIO1: U3.20(B2)
FTDIA_JTAG_nSRST: U3.18(B4)
FTDIA_JTAG_nTRST: U3.17(B5)
FTDIA_JTAG_TCK: U3.14(B8)
FTDIA_JTAG_TDI: U3.15(B7)
FTDIA_JTAG_TDO: U12.16(B6)
FTDIA_JTAG_TMS: U3.16(B6)
FTDIB_3V3_OUT_BS0: U4.7(A5)
FTDIB_3V3_OUT_BS1: U4.6(A4)
FTDIB_3V3_OUT_BS2: U4.5(A3)
FTDIB_3V3_OUT_BS3: U4.4(A2)
FTDIB_3V3_SPI_CS: U4.8(A6)
FTDIB_3V3_SPI_DI: U12.7(A5)
FTDIB_3V3_SPI_DO: U4.9(A7)
FTDIB_3V3_SPI_SCK: U4.10(A8)
FTDIB_SPI_BS0: U4.17(B5)
FTDIB_SPI_BS1: U4.18(B4)
FTDIB_SPI_BS2: U4.19(B3)
FTDIB_SPI_BS3: U4.20(B2)
FTDIB_SPI_CS: U4.16(B6)
FTDIB_SPI_DI: U12.17(B5)
FTDIB_SPI_DO: U4.15(B7)
FTDIB_SPI_SCK: U4.14(B8)
FTDIC_3V3_SER1_RX: U12.5(A3)
FTDIC_3V3_SER1_TX: U3.3(A1)
FTDIC_SER1_RX: U12.19(B3)
FTDIC_SER1_TX: U3.21(B1)
FTDID_3V3_GPIOL0: U12.4(A2)
FTDID_3V3_GPIOL1: U12.3(A1)
FTDID_3V3_SER2_RX: U12.6(A4)
FTDID_3V3_SER2_TX: U4.3(A1)
FTDID_SER2_RX: U12.18(B4)
FTDID_SER2_TX: U4.21(B1)
NetJP7_1: JP7.1 R184.1 U12.21(B1)
NetJP7_2: JP7.2 R185.1 U12.20(B2)
NetR2_1: R2.1 U3.22(~{OE})
NetR179_1: R179.1 U3.2(DIR)
NetR180_1: R180.1 U4.22(~{OE})
NetR181_1: R181.1 U4.2(DIR)
NetR182_1: R182.1 U12.22(~{OE})
NetR183_1: R183.1 U12.2(DIR)

Not connected (* = marked no-connect by the designer): U12 9(A7) 10(A8)

### Notes on the sheet
- Title:
- Date:
- Rev:
- Time:
- Project:
- Sheet
- of
- License:
- Copyright © NewAE Technology Inc.
- Approved:
- NewAE.com
- File:

### Library data of the parts
C1 C22-C26 = CCHIP-100n-0402: as C41 on sheet CW340_FTDI; Part Number: CCHIP-100n-0402; Footprint: 0402; Pin Count: 2; Supplier 1: Digi-Key; Supplier Part Number 1: 445-6901-1-ND; Value: 100n; Mounting Technology: SMT; Component Kind: Standard; Component Type: Standard
JP7 JP13 = Header 3: Header, 3-Pin; LatestRevisionDate: 17-Jul-2002; LatestRevisionNote: Re-released for DXP Platform.; Publisher: Altium Limited
R2 R179-R183 = RCHIP-10K-0402: as R27 on sheet CW340_FTDI; Part Number: RCHIP-10K-0402; Footprint: 0402; Pin Count: 2; Supplier 1: Digi-Key; Supplier Part Number 1: 311-10.0KLRCT-ND; Value: 10k; Tolerance: 1%; Mounting Technology: SMT; Temperature Range: -55C to 155C; Component Kind: Standard; Component Type: Standard
R184 R185 = RCHIP-100K-0603: 100k res, 0603, 1%, 1/10W; Manufacture 1: Yageo; Manufacture Part Number 1: RC0603FR-07100KL; Component Group: Resistor; Case-EIA: 0603; Case-Metric: 1608; Rated Power: 0.1W; Rated Voltage: 75VDC; Part Number: RCHIP-100K-0603; Footprint: 0603; Pin Count: 2; Supplier 1: Digi-Key; Supplier Part Number 1: 311-100KHRCT-ND; Value: 100k; Tolerance: 1%; Mounting Technology: SMT; Temperature Range: -55C to 155C; Component Kind: Standard; Component Type: Standard
U3 U4 U12 = CMP-04899-000027-1: IC TRNSLTR BIDIRECTIONAL 24TSSOP; Manufacturer: Texas Instruments; V B Min: 1.65V; V B Max: 5.5V; Number Of Outputs: 8; Standoff Height: 0.05mm; Nominal Supply Current: 25uA; Number Of Circuits: 1; Propagation Delay: 4.3ns; Logic Function Desc: Non-Inverting; Ambient Temperature Range High: +85°C; Temperature Range Low: -40°C; Category: IC; Min Supply Voltage: 1.65V; Device Class L2: Logic ICs; Digikey Description: IC TRNSLTR BIDIRECTIONAL 24TSSOP; ComponentLink2Description: Datasheet; V A Min: 1.65V; Height: 1.2mm; Device Class L1: Integrated Circuits (ICs); Manufacturer Part Number: SN74LVC8T245PWR; Ipc Land Pattern Name: SOP65P640X120-24; Lead Free: Yes; Device Class L3: Voltage Level Shifters; Octopart: https://octopart.com/sn74lvc8t245pwr-texas+instruments-517164; RoHS: TRUE; Ambient Temperature Range Low: -40°C; Number Of Inputs: 8; Automotive: No; V A Max: 5.5V; Mouser Description: Translation - Voltage Levels 8-Bit Dual-Supply Bus Xcvr; Temperature Range High: +85°C; ComponentLink2URL: http://www.ti.com/lit/ds/symlink/sn74lvc8t245.pdf; Temperature: -40°C to +85°C; Package: PW0024A; Max Supply Voltage: 5.5V